# Altium schematic sheet subsystems.SchDoc: Subsystem Interfaces
size A4; DocumentNumber: 1; Revision: v0.8; SheetNumber: 1; SheetTotal: 6
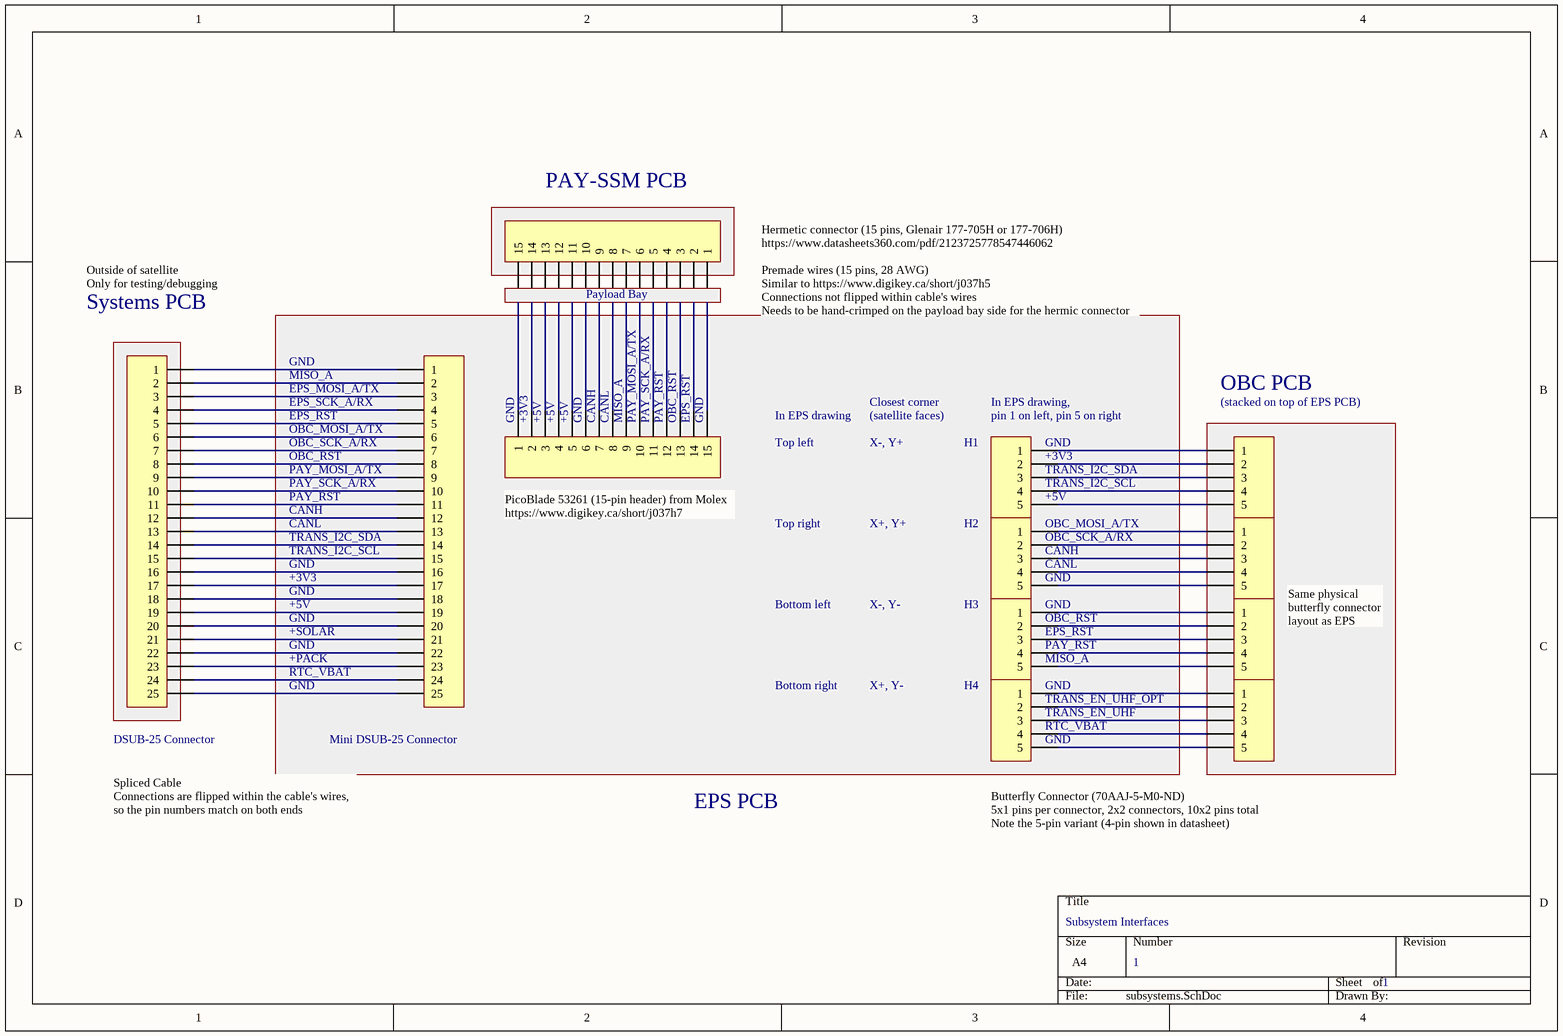
[diagram p0: subsystems.SchDoc]

## Parts
(Parts that share a designator on the sheet are numbered #1, #2 ... from top to bottom, then left to right.)
P?#1  Header 15  [HDR1X15]  (value not drawn)
P?#2  Header 25  [HDR1X25]  (value not drawn)
P?#3  Header 25  [HDR1X25]  (value not drawn)
P?#4  Header 15  [HDR1X15]  (value not drawn)
P?#5  Header 5  [HDR1X5]  (value not drawn)
P?#6  Header 5  [HDR1X5]  (value not drawn)
P?#7  Header 5  [HDR1X5]  (value not drawn)
P?#8  Header 5  [HDR1X5]  (value not drawn)
P?#9  Header 5  [HDR1X5]  (value not drawn)
P?#10  Header 5  [HDR1X5]  (value not drawn)
P?#11  Header 5  [HDR1X5]  (value not drawn)
P?#12  Header 5  [HDR1X5]  (value not drawn)

## Blocks framed on the sheet
PAY-SSM PCB: P?#1
(stacked on top of EPS PCB): P?#6 P?#8 P?#10 P?#12

## Nets
NetP?#2_1: P?#2.1 P?#3.1
NetP?#2_2: P?#2.2 P?#3.2
NetP?#2_3: P?#2.3 P?#3.3
NetP?#2_4: P?#2.4 P?#3.4
NetP?#2_5: P?#2.5 P?#3.5
NetP?#2_6: P?#2.6 P?#3.6
NetP?#2_7: P?#2.7 P?#3.7
NetP?#2_8: P?#2.8 P?#3.8
NetP?#2_9: P?#2.9 P?#3.9
NetP?#2_10: P?#2.10 P?#3.10
NetP?#2_11: P?#2.11 P?#3.11
NetP?#2_12: P?#2.12 P?#3.12
NetP?#2_13: P?#2.13 P?#3.13
NetP?#2_14: P?#2.14 P?#3.14
NetP?#2_15: P?#2.15 P?#3.15
NetP?#2_16: P?#2.16 P?#3.16
NetP?#2_17: P?#2.17 P?#3.17
NetP?#2_18: P?#2.18 P?#3.18
NetP?#2_19: P?#2.19 P?#3.19
NetP?#2_20: P?#2.20 P?#3.20
NetP?#2_21: P?#2.21 P?#3.21
NetP?#2_22: P?#2.22 P?#3.22
NetP?#2_23: P?#2.23 P?#3.23
NetP?#2_24: P?#2.24 P?#3.24
NetP?#2_25: P?#2.25 P?#3.25
NetP?#5_1: P?#5.1 P?#6.1
NetP?#5_2: P?#5.2 P?#6.2
NetP?#5_3: P?#5.3 P?#6.3
NetP?#5_4: P?#5.4 P?#6.4
NetP?#5_5: P?#5.5 P?#6.5
NetP?#7_1: P?#7.1 P?#8.1
NetP?#7_2: P?#7.2 P?#8.2
NetP?#7_3: P?#7.3 P?#8.3
NetP?#7_4: P?#7.4 P?#8.4
NetP?#7_5: P?#7.5 P?#8.5
NetP?#9_1: P?#9.1 P?#10.1
NetP?#9_2: P?#9.2 P?#10.2
NetP?#9_3: P?#9.3 P?#10.3
NetP?#9_4: P?#9.4 P?#10.4
NetP?#9_5: P?#9.5 P?#10.5
NetP?#11_1: P?#11.1 P?#12.1
NetP?#11_2: P?#11.2 P?#12.2
NetP?#11_3: P?#11.3 P?#12.3
NetP?#11_4: P?#11.4 P?#12.4
NetP?#11_5: P?#11.5 P?#12.5

Not connected (* = marked no-connect by the designer): P?#1 1 2 3 4 5 6 7 8 9 10 11 12 13 14 15; P?#4 1 2 3 4 5 6 7 8 9 10 11 12 13 14 15

## Notes on the sheet
- Hermetic connector (15 pins, Glenair 177-705H or 177-706H)
  https://www.datasheets360.com/pdf/2123725778547446062
- Systems PCB
- Outside of satellite
  Only for testing/debugging
- (near P?#1) Payload Bay
- Premade wires (15 pins, 28 AWG)
  Similar to https://www.digikey.ca/short/j037h5
  Connections not flipped within cable's wires
  Needs to be hand-crimped on the payload bay side for the hermic connector
- GND
- MISO_A
- EPS_MOSI_A/TX
- EPS_SCK_A/RX
- EPS_RST
- OBC_MOSI_A/TX
- OBC_SCK_A/RX
- (near P?#4) GND
- (near P?#4) +3V3
- (near P?#4) +5V
- (near P?#4) CANH
- (near P?#4) CANL
- (near P?#4) MISO_A
- (near P?#4) PAY_MOSI_A/TX
- (near P?#4) PAY_SCK_A/RX
- (near P?#4) PAY_RST
- (near P?#4) OBC_RST
- (near P?#4) EPS_RST
- In EPS drawing
- Top left
- X-, Y+
- Closest corner
- (satellite faces)
- H1
- (near P?#5) In EPS drawing,
- (near P?#5) pin 1 on left, pin 5 on right
- (near P?#5) GND
- OBC PCB
- OBC_RST
- PAY_MOSI_A/TX
- PAY_SCK_A/RX
- PAY_RST
- CANH
- PicoBlade 53261 (15-pin header) from Molex
  https://www.digikey.ca/short/j037h7
- (near P?#5) +3V3
- (near P?#5) +5V
- (near P?#5) TRANS_I2C_SDA
- (near P?#5) TRANS_I2C_SCL
- TRANS_I2C_SDA
- CANL
- TRANS_I2C_SCL
- +3V3
- Top right
- X+, Y+
- H2
- (near P?#7) CANH
- (near P?#7) CANL
- (near P?#7) OBC_MOSI_A/TX
- (near P?#7) OBC_SCK_A/RX
- (near P?#7) GND
- +5V
- +SOLAR
- Bottom left
- X-, Y-
- H3
- (near P?#9) EPS_RST
- (near P?#9) PAY_RST
- (near P?#9) OBC_RST
- (near P?#9) GND
- Same physical butterfly connector layout as EPS
- +PACK
- RTC_VBAT
- Bottom right
- X+, Y-
- H4
- (near P?#9) MISO_A
- (near P?#11) TRANS_EN_UHF_OPT
- (near P?#11) TRANS_EN_UHF
- (near P?#11) GND
- (near P?#2) DSUB-25 Connector
- (near P?#3) Mini DSUB-25 Connector
- (near P?#11) RTC_VBAT
- Spliced Cable
  Connections are flipped within the cable's wires,
  so the pin numbers match on both ends
- EPS PCB
- (near P?#11) Butterfly Connector (70AAJ-5-M0-ND)
  5x1 pins per connector, 2x2 connectors, 10x2 pins total
  Note the 5-pin variant (4-pin shown in datasheet)

## Library data of the parts
P?#1 P?#4 = Header 15: Header, 15-Pin; LatestRevisionDate: 17-Jul-2002; LatestRevisionNote: Re-released for DXP Platform.; Publisher: Altium Limited
P?#2 P?#3 = Header 25: Header, 25-Pin; LatestRevisionDate: 17-Jul-2002; LatestRevisionNote: Re-released for DXP Platform.; Publisher: Altium Limited
P?#5-P?#12 = Header 5: Header, 5-Pin; LatestRevisionDate: 17-Jul-2002; LatestRevisionNote: Re-released for DXP Platform.; Publisher: Altium Limited